# EAGLE schematic Sensor Board (EAGLE 6.5.0)
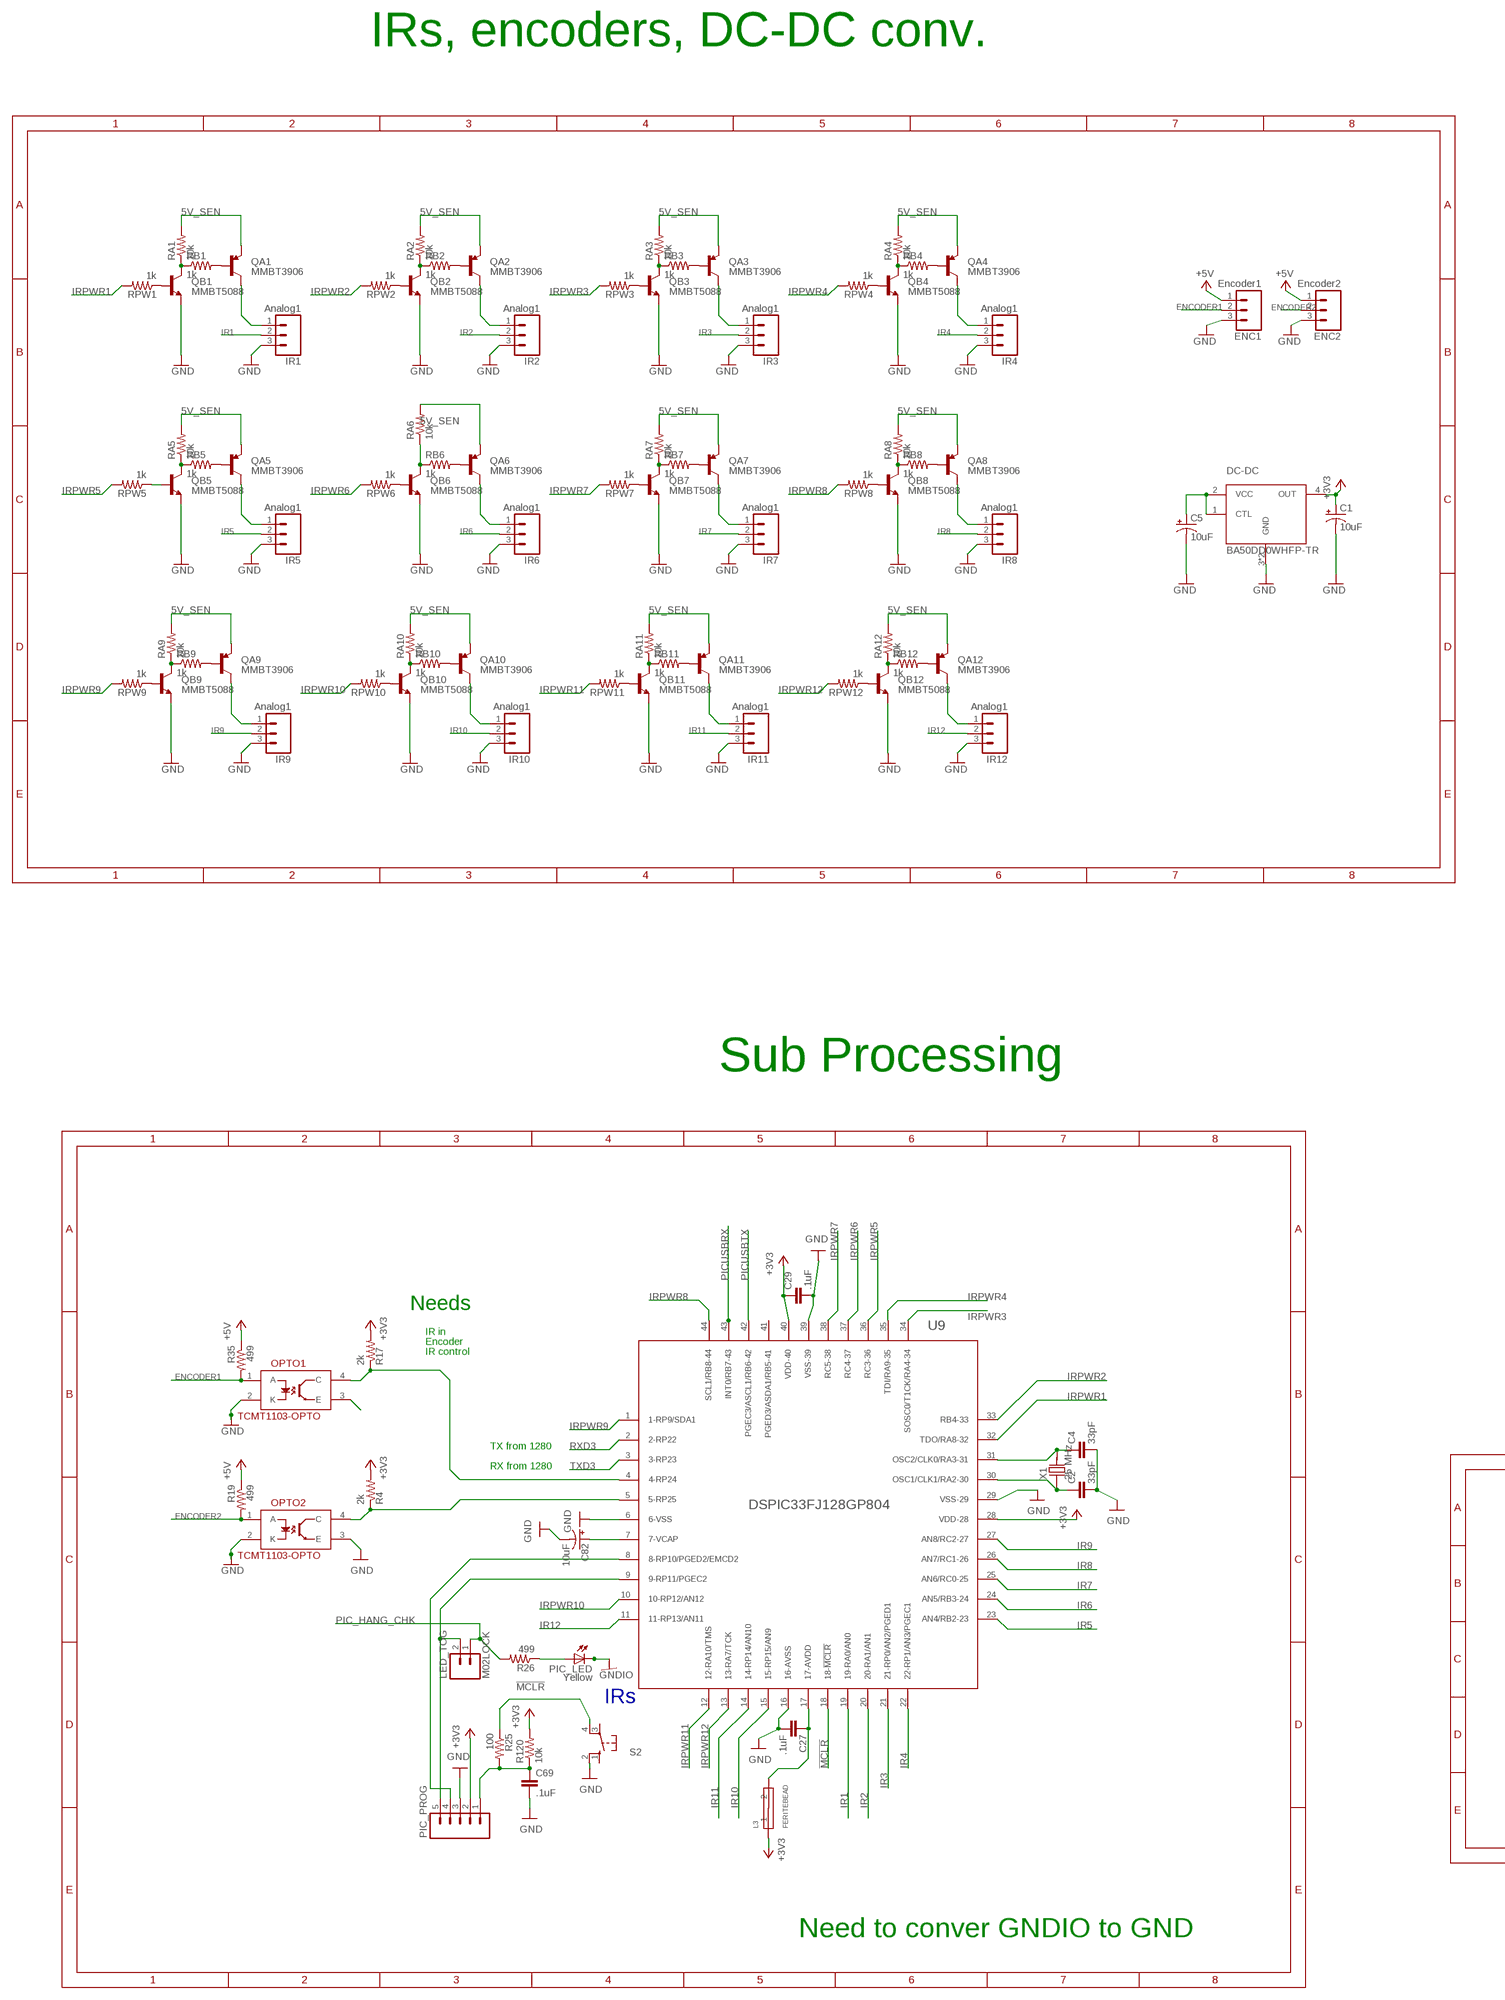
[diagram p0: schematic, sheet 1, part 1 of 3]
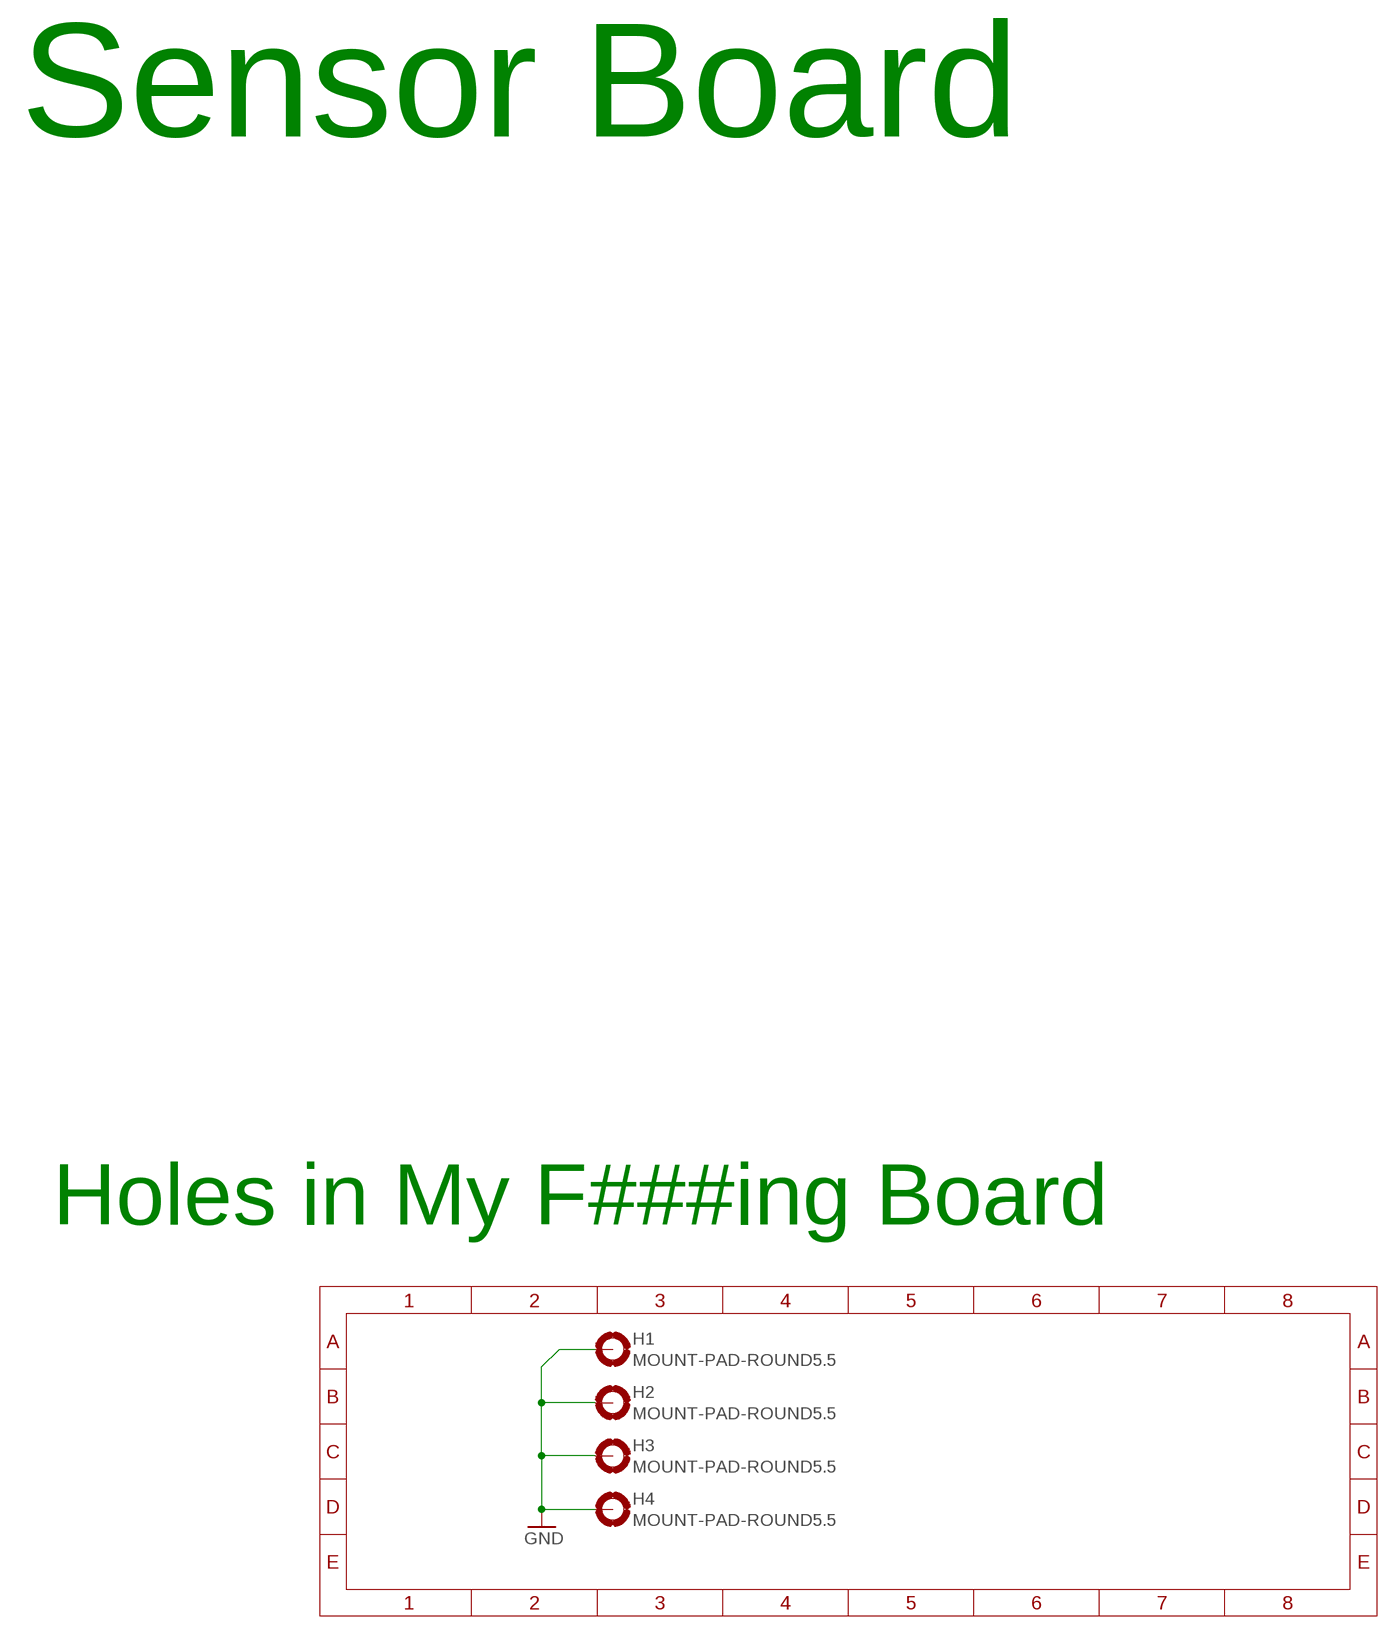
[diagram p1: schematic, sheet 1, part 2 of 3]
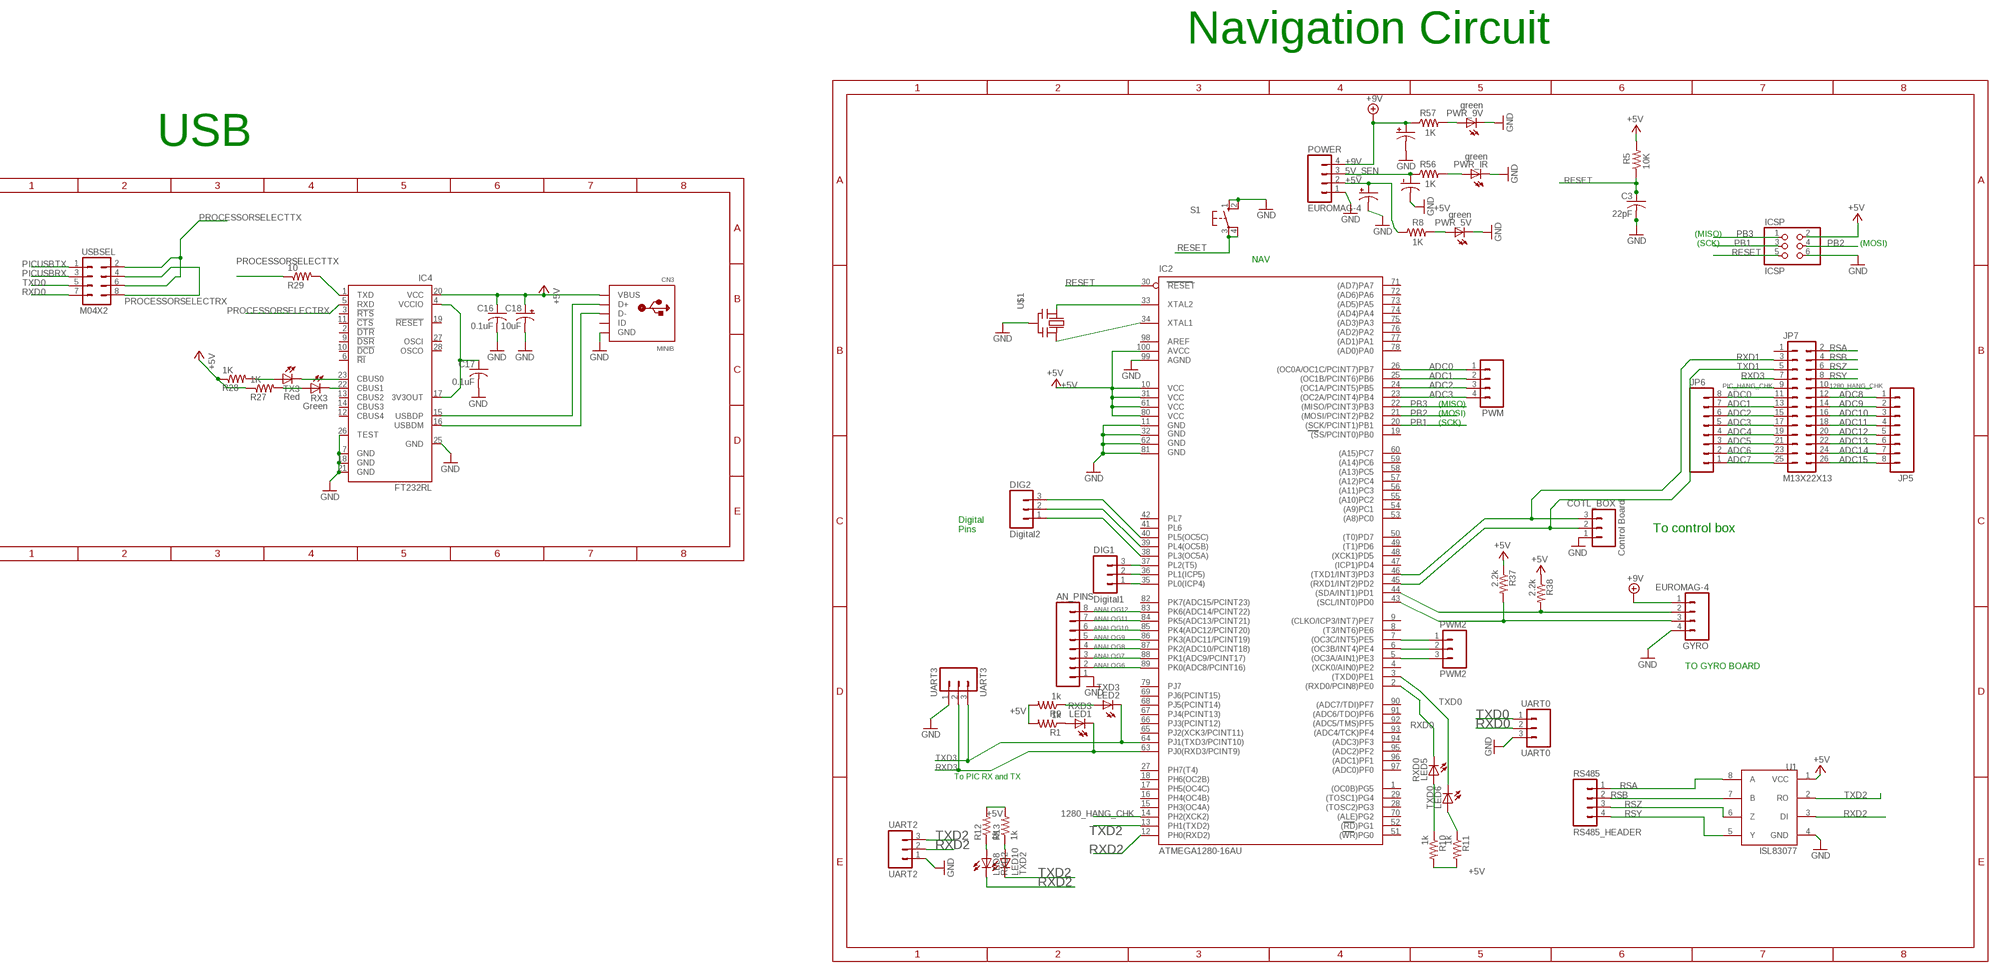
[diagram p2: schematic, sheet 1, part 3 of 3]

## Parts
AN_PINS  M08LOCK_LONGPADS  [1X08_LOCK_LONGPADS]
C1  10uF  CAP_POL1206  [EIA3216]
C2  33pF  1UF-25V-10%(0805)  [0805]
C3  22pF  C-USC0805K  [C0805K]
C4  33pF  1UF-25V-10%(0805)  [0805]
C5  10uF  CAP_POL1206  [EIA3216]
C16  0.1uF  C-USC0805K  [C0805K]
C17  0.1uF  C-USC0805K  [C0805K]
C18  10uF  CAP_POL3528-KIT  [EIA3528-KIT]
C27  .1uF  1UF-25V-10%(0805)  [0805]
C29  .1uF  1UF-25V-10%(0805)  [0805]
C69  .1uF  1UF-25V-10%(0805)  [0805]
C82  10uF  POLCAP  [POLC1206]
CAN1  EMVY160ADA101MF55G  CPOL-US140CLH-1010  [140CLH-1010]
CAN2  EMVY160ADA101MF55G  CPOL-US140CLH-1010  [140CLH-1010]
CAN3  EMVY160ADA101MF55G  CPOL-US140CLH-1010  [140CLH-1010]
CN3  MINIB  USBMINIB  [USB-MINIB]
COTL_BOX  Control Board  M03POLAR_LOCK  [MOLEX-1X3_LOCK]
DC-DC  BA50DD0WHFP-TR  [HRP5]
DIG1  Digital1  EUROMAG-390DEG  [M3]
DIG2  Digital2  EUROMAG-390DEG  [M3]
ENC1  Encoder1  EUROMAG-390DEG  [M3]
ENC2  Encoder2  EUROMAG-390DEG  [M3]
GYRO  EUROMAG-4  [M4]
H1  MOUNT-PAD-ROUND5.5  [5,5-PAD]
H2  MOUNT-PAD-ROUND5.5  [5,5-PAD]
H3  MOUNT-PAD-ROUND5.5  [5,5-PAD]
H4  MOUNT-PAD-ROUND5.5  [5,5-PAD]
IC2  ATMEGA1280-16AU  [TQFP100]
IC4  FT232RL  [SSOP28]
ICSP  ICSP  PINHD-2X3  [2X03]
IR1  Analog1  EUROMAG-390DEG  [M3]
IR2  Analog1  EUROMAG-390DEG  [M3]
IR3  Analog1  EUROMAG-390DEG  [M3]
IR4  Analog1  EUROMAG-390DEG  [M3]
IR5  Analog1  EUROMAG-390DEG  [M3]
IR6  Analog1  EUROMAG-390DEG  [M3]
IR7  Analog1  EUROMAG-390DEG  [M3]
IR8  Analog1  EUROMAG-390DEG  [M3]
IR9  Analog1  EUROMAG-390DEG  [M3]
IR10  Analog1  EUROMAG-390DEG  [M3]
IR11  Analog1  EUROMAG-390DEG  [M3]
IR12  Analog1  EUROMAG-390DEG  [M3]
JP5  M08LOCK_LONGPADS  [1X08_LOCK_LONGPADS]
JP6  M08LOCK_LONGPADS  [1X08_LOCK_LONGPADS]
JP7  M13X22X13  [2X13]
L3  FERITEBEAD  [0603]
LED1  RXD3  LEDCHIP-LED0805  [CHIP-LED0805]
LED2  TXD3  LEDCHIP-LED0805  [CHIP-LED0805]
LED5  RXD0  LEDCHIP-LED0805  [CHIP-LED0805]
LED6  TXD0  LEDCHIP-LED0805  [CHIP-LED0805]
LED8  RXD2  LEDCHIP-LED0805  [CHIP-LED0805]
LED10  TXD2  LEDCHIP-LED0805  [CHIP-LED0805]
LED_TOG  M02LOCK  [1X02_LOCK]
OPTO1  TCMT1103-OPTO  [SSOP-4]
OPTO2  TCMT1103-OPTO  [SSOP-4]
PIC_LED  Yellow  LEDCHIP-LED0805  [CHIP-LED0805]
PIC_PROG  M05LOCK_LONGPADS  [1X05_LOCK_LONGPADS]
POWER  EUROMAG-4  [M4]
PWM  M04POLAR  [MOLEX-1X4]
PWM2  PWM2  M03POLAR_LOCK  [MOLEX-1X3_LOCK]
PWR_5V  green  LEDCHIPLED_0805  [CHIPLED_0805]
PWR_9V  green  LEDCHIPLED_0805  [CHIPLED_0805]
PWR_IR  green  LEDCHIPLED_0805  [CHIPLED_0805]
QA1  MMBT3906  TRANSISTOR_PNPMMBT3906  [SOT23]
QA2  MMBT3906  TRANSISTOR_PNPMMBT3906  [SOT23]
QA3  MMBT3906  TRANSISTOR_PNPMMBT3906  [SOT23]
QA4  MMBT3906  TRANSISTOR_PNPMMBT3906  [SOT23]
QA5  MMBT3906  TRANSISTOR_PNPMMBT3906  [SOT23]
QA6  MMBT3906  TRANSISTOR_PNPMMBT3906  [SOT23]
QA7  MMBT3906  TRANSISTOR_PNPMMBT3906  [SOT23]
QA8  MMBT3906  TRANSISTOR_PNPMMBT3906  [SOT23]
QA9  MMBT3906  TRANSISTOR_PNPMMBT3906  [SOT23]
QA10  MMBT3906  TRANSISTOR_PNPMMBT3906  [SOT23]
QA11  MMBT3906  TRANSISTOR_PNPMMBT3906  [SOT23]
QA12  MMBT3906  TRANSISTOR_PNPMMBT3906  [SOT23]
QB1  MMBT5088  TRANSISTOR_NPNMMBT5088  [SOT23]
QB2  MMBT5088  TRANSISTOR_NPNMMBT5088  [SOT23]
QB3  MMBT5088  TRANSISTOR_NPNMMBT5088  [SOT23]
QB4  MMBT5088  TRANSISTOR_NPNMMBT5088  [SOT23]
QB5  MMBT5088  TRANSISTOR_NPNMMBT5088  [SOT23]
QB6  MMBT5088  TRANSISTOR_NPNMMBT5088  [SOT23]
QB7  MMBT5088  TRANSISTOR_NPNMMBT5088  [SOT23]
QB8  MMBT5088  TRANSISTOR_NPNMMBT5088  [SOT23]
QB9  MMBT5088  TRANSISTOR_NPNMMBT5088  [SOT23]
QB10  MMBT5088  TRANSISTOR_NPNMMBT5088  [SOT23]
QB11  MMBT5088  TRANSISTOR_NPNMMBT5088  [SOT23]
QB12  MMBT5088  TRANSISTOR_NPNMMBT5088  [SOT23]
R1  1k  R-US_R0805  [R0805]
R4  2k  R-US_R0805  [R0805]
R5  10K  R-US_R0805  [R0805]
R8  1K  R-US_R0805  [R0805]
R9  1k  R-US_R0805  [R0805]
R10  1k  R-US_R0805  [R0805]
R11  1k  R-US_R0805  [R0805]
R12  1k  R-US_R0805  [R0805]
R13  1k  R-US_R0805  [R0805]
R17  2k  R-US_R0805  [R0805]
R19  499  R-US_R0805  [R0805]
R25  100  R-US_R0805  [R0805]
R26  499  R-US_R0805  [R0805]
R27  1K  R-US_R0805  [R0805]
R28  1K  R-US_R0805  [R0805]
R29  10  R-US_R0805  [R0805]
R35  499  R-US_R0805  [R0805]
R37  2.2k  R-US_R0805  [R0805]
R38  2.2k  R-US_R0805  [R0805]
R56  1K  R-US_R0805  [R0805]
R57  1K  R-US_R0805  [R0805]
R120  10k  R-US_R0805  [R0805]
RA1  10k  RESISTOR0805-RES  [0805]
RA2  10k  RESISTOR0805-RES  [0805]
RA3  10k  RESISTOR0805-RES  [0805]
RA4  10k  RESISTOR0805-RES  [0805]
RA5  10k  RESISTOR0805-RES  [0805]
RA6  10k  RESISTOR0805-RES  [0805]
RA7  10k  RESISTOR0805-RES  [0805]
RA8  10k  RESISTOR0805-RES  [0805]
RA9  10k  RESISTOR0805-RES  [0805]
RA10  10k  RESISTOR0805-RES  [0805]
RA11  10k  RESISTOR0805-RES  [0805]
RA12  10k  RESISTOR0805-RES  [0805]
RB1  1k  RESISTOR0805-RES  [0805]
RB2  1k  RESISTOR0805-RES  [0805]
RB3  1k  RESISTOR0805-RES  [0805]
RB4  1k  RESISTOR0805-RES  [0805]
RB5  1k  RESISTOR0805-RES  [0805]
RB6  1k  RESISTOR0805-RES  [0805]
RB7  1k  RESISTOR0805-RES  [0805]
RB8  1k  RESISTOR0805-RES  [0805]
RB9  1k  RESISTOR0805-RES  [0805]
RB10  1k  RESISTOR0805-RES  [0805]
RB11  1k  RESISTOR0805-RES  [0805]
RB12  1k  RESISTOR0805-RES  [0805]
RPW1  1k  RESISTOR0805-RES  [0805]
RPW2  1k  RESISTOR0805-RES  [0805]
RPW3  1k  RESISTOR0805-RES  [0805]
RPW4  1k  RESISTOR0805-RES  [0805]
RPW5  1k  RESISTOR0805-RES  [0805]
RPW6  1k  RESISTOR0805-RES  [0805]
RPW7  1k  RESISTOR0805-RES  [0805]
RPW8  1k  RESISTOR0805-RES  [0805]
RPW9  1k  RESISTOR0805-RES  [0805]
RPW10  1k  RESISTOR0805-RES  [0805]
RPW11  1k  RESISTOR0805-RES  [0805]
RPW12  1k  RESISTOR0805-RES  [0805]
RS485_HEADER  RS485  EUROMAG-4UP  [M4-90]
RX3  Green  LEDCHIP-LED0805  [CHIP-LED0805]
S1  10-XX  [B3F-10XX]
S2  10-XX  [B3F-10XX]
TX3  Red  LEDCHIP-LED0805  [CHIP-LED0805]
U1  ISL83077  [SO08]
U9  DSPIC33FJ128GP804  DSPIC33FJ128GP204  [TQFP-44]
U$1  CERMOSCILL-AWCSR  [AWCSR]
UART0  UART0  M03PTH  [1X03]
UART2  UART2  M03PTH  [1X03]
UART3  UART3  M03PTH  [1X03]
USBSEL  M04X2  [2X4]
X1  25 MHz  XRCGBCRYSTAL  [XRCGB-CYL]

## Nets
5V_SEN: CAN2.+ POWER.3 QA1.2(E) QA2.2(E) QA3.2(E) QA4.2(E) QA5.2(E) QA6.2(E) QA7.2(E) QA8.2(E) QA9.2(E) QA10.2(E) QA11.2(E) QA12.2(E) R56.1 RA1.2 RA2.2 RA3.2 RA4.2 RA5.2 RA6.2 RA7.2 RA8.2 RA9.2 RA10.2 RA11.2 RA12.2
1280_HANG_CHK: IC2.14(PH2(XCK2)) JP7.10
!MCLR: R25.1 S2.4(P1) U9.18(18-!MCLR)
+3V3: C1.A(+) C29.1 DC-DC.4(OUT) L3.1 PIC_PROG.2 R4.2 R17.2 R120.2 U9.28(VDD-28) U9.40(VDD-40)
+5V [usbvcc]: C5.A(+) C16.1 C18.A(+) CAN3.+ CN3.VBUS DC-DC.1(CTL) DC-DC.2(VCC) ENC1.1 ENC2.1 IC2.10(VCC) IC2.31(VCC1) IC2.61(VCC2) IC2.80(VCC3) IC2.100(AVCC) IC4.20(VCC) ICSP.2 POWER.2 R1.2 R5.2 R8.1 R9.2 R10.2 R11.2 R12.2 R13.2 R19.1 R27.1 R28.1 R35.1 R37.1 R38.1 U1.1(VCC)
+9V: CAN1.+ GYRO.1 POWER.4 R57.1
ADC0: IC2.26((OC0A/OC1C/PCINT7)PB7) JP6.8 JP7.11 PWM.1
ADC1: IC2.25((OC1B/PCINT6)PB6) JP6.7 JP7.13 PWM.2
ADC2: IC2.24((OC1A/PCINT5)PB5) JP6.6 JP7.15 PWM.3
ADC3: IC2.23((OC2A/PCINT4)PB4) JP6.5 JP7.17 PWM.4
ADC4: JP6.4 JP7.19
ADC5: JP6.3 JP7.21
ADC6: JP6.2 JP7.23
ADC7: JP6.1 JP7.25
ADC8: JP5.1 JP7.12
ADC9: JP5.2 JP7.14
ADC10: JP5.3 JP7.16
ADC11: JP5.4 JP7.18
ADC12: JP5.5 JP7.20
ADC13: JP5.6 JP7.22
ADC14: JP5.7 JP7.24
ADC15: JP5.8 JP7.26
ANALOG6: AN_PINS.2 IC2.89(PK0(ADC8/PCINT16))
ANALOG7: AN_PINS.3 IC2.88(PK1(ADC9/PCINT17))
ANALOG8: AN_PINS.4 IC2.87(PK2(ADC10/PCINT18))
ANALOG9: AN_PINS.5 IC2.86(PK3(ADC11/PCINT19))
ANALOG10: AN_PINS.6 IC2.85(PK4(ADC12/PCINT20))
ANALOG11: AN_PINS.7 IC2.84(PK5(ADC13/PCINT21))
ANALOG12: AN_PINS.8 IC2.83(PK6(ADC14/PCINT22))
ANBNKJDFBNDFKJL: OPTO1.4(C) R17.1 U9.4(4-RP24)
ANBNKJDFBNDFKJL1: OPTO2.4(C) R4.1 U9.5(5-RP25)
ENCODER1: ENC1.2 OPTO1.1(A) R35.2
ENCODER2: ENC2.2 OPTO2.1(A) R19.2
GND: AN_PINS.1 C1.C(-) C2.2 C3.2 C4.2 C5.C(-) C16.2 C17.2 C18.C(-) C27.2 C29.2 C69.2 C82.2(-) CAN1.- CAN2.- CAN3.- CN3.GND COTL_BOX.1 DC-DC.3(GND) DC-DC.G(GND) ENC1.3 ENC2.3 GYRO.4 H1.B5,5(MOUNT) H2.B5,5(MOUNT) H3.B5,5(MOUNT) H4.B5,5(MOUNT) IC2.11(GND) IC2.32(GND1) IC2.62(GND2) IC2.81(GND3) IC2.99(AGND) IC4.7(GND) IC4.18(GND) IC4.21(GND) IC4.25(GND) IC4.26(TEST) ICSP.6 IR1.3 IR2.3 IR3.3 IR4.3 IR5.3 IR6.3 IR7.3 IR8.3 IR9.3 IR10.3 IR11.3 IR12.3 OPTO1.2(K) OPTO2.2(K) OPTO2.3(E) PIC_PROG.3 POWER.1 PWR_5V.C PWR_9V.C PWR_IR.C QB1.2(E) QB2.2(E) QB3.2(E) QB4.2(E) QB5.2(E) QB6.2(E) QB7.2(E) QB8.2(E) QB9.2(E) QB10.2(E) QB11.2(E) QB12.2(E) S1.1(S) S1.2(S1) S2.2(S1) U1.4(GND) U9.6(6-VSS) U9.16(16-AVSS) U9.29(VSS-29) U9.39(VSS-39) U$1.2(GND) UART0.3 UART2.1 UART3.1
GNDIO: PIC_LED.C
IR1: IR1.2 U9.19(19-RA0/AN0)
IR2: IR2.2 U9.20(20-RA1/AN1)
IR3: IR3.2 U9.21(21-RP0/AN2/PGED1)
IR4: IR4.2 U9.22(22-RP1/AN3/PGEC1)
IR5: IR5.2 U9.23(AN4/RB2-23)
IR6: IR6.2 U9.24(AN5/RB3-24)
IR7: IR7.2 U9.25(AN6/RC0-25)
IR8: IR8.2 U9.26(AN7/RC1-26)
IR9: IR9.2 U9.27(AN8/RC2-27)
IR10: IR10.2 U9.15(15-RP15/AN9)
IR11: IR11.2 U9.14(14-RP14/AN10)
IR12: IR12.2 U9.11(11-RP13/AN11)
IRPWR1: RPW1.2 U9.32(TDO/RA8-32)
IRPWR2: RPW2.2 U9.33(RB4-33)
IRPWR3: RPW3.2 U9.34(SOSC0/T1CK/RA4-34)
IRPWR4: RPW4.2 U9.35(TDI/RA9-35)
IRPWR5: RPW5.2 U9.36(RC3-36)
IRPWR6: RPW6.2 U9.37(RC4-37)
IRPWR7: RPW7.2 U9.38(RC5-38)
IRPWR8: RPW8.2 U9.44(SCL1/RB8-44)
IRPWR9: RPW9.2 U9.1(1-RP9/SDA1)
IRPWR10: RPW10.2 U9.10(10-RP12/AN12)
IRPWR11: RPW11.2 U9.12(12-RA10/TMS)
IRPWR12: RPW12.2 U9.13(13-RA7/TCK)
N$1: QA2.1(B) RB2.2
N$2: QB2.3(C) RA2.1 RB2.1
N$3: PWR_5V.A R8.2
N$4: QB2.1(B) RPW2.1
N$5: QA1.1(B) RB1.2
N$6: IC2.34(XTAL1) U$1.3(OUT)
N$7: IC2.33(XTAL2) U$1.1(IN)
N$8: QB1.3(C) RA1.1 RB1.1
N$9: QB1.1(B) RPW1.1
N$10: IR1.1 QA1.3(C)
N$11: PIC_PROG.4 U9.8(8-RP10/PGED2/EMCD2)
N$12: LED2.A R9.1
N$13: C4.1 U9.31(OSC2/CLK0/RA3-31) X1.3(OUT)
N$14: C2.1 U9.30(OSC1/CLK1/RA2-30) X1.1(IN)
N$15: C69.1 PIC_PROG.1 R25.2 R120.1
N$16: C82.1(+) U9.7(7-VCAP)
N$17: IR2.1 QA2.3(C)
N$18: QA3.1(B) RB3.2
N$19: QB3.3(C) RA3.1 RB3.1
N$20: LED_TOG.2 PIC_PROG.5 U9.9(9-RP11/PGEC2)
N$21: QB3.1(B) RPW3.1
N$22: IC2.7((OC3C/INT5)PE5) PWM2.1
N$23: C27.1 L3.2 U9.17(17-AVDD)
N$24: IR3.1 QA3.3(C)
N$25: QA4.1(B) RB4.2
N$26: QB4.3(C) RA4.1 RB4.1
N$27: QB4.1(B) RPW4.1
N$28: IR4.1 QA4.3(C)
N$29: QA5.1(B) RB5.2
N$30: IC2.6((OC3B/INT4)PE4) PWM2.2
N$31: LED1.A R1.1
N$32: IC2.5((OC3A/AIN1)PE3) PWM2.3
N$33: QB5.3(C) RA5.1 RB5.1
N$34: QB5.1(B) RPW5.1
N$35: LED10.A R13.1
N$36: IR5.1 QA5.3(C)
N$37: PWR_IR.A R56.2
N$38: LED8.A R12.1
N$39: PWR_9V.A R57.2
N$40: DIG1.1 IC2.35(PL0(ICP4))
N$41: LED6.A R11.1
N$44: DIG1.2 IC2.36(PL1(ICP5))
N$45: QA6.1(B) RB6.2
N$46: DIG1.3 IC2.37(PL2(T5))
N$47: DIG2.1 IC2.38(PL3(OC5A))
N$48: QB6.3(C) RA6.1 RB6.1
N$49: DIG2.2 IC2.39(PL4(OC5B))
N$50: DIG2.3 IC2.40(PL5(OC5C))
N$51: LED5.A R10.1
N$52: QB6.1(B) RPW6.1
N$53: IR6.1 QA6.3(C)
N$54: QA7.1(B) RB7.2
N$55: QB7.3(C) RA7.1 RB7.1
N$56: QB7.1(B) RPW7.1
N$57: GYRO.2 IC2.44((SDA/INT1)PD1) R38.2
N$58: GYRO.3 IC2.43((SCL/INT0)PD0) R37.2
N$59: IR7.1 QA7.3(C)
N$60: QA8.1(B) RB8.2
N$61: QB8.3(C) RA8.1 RB8.1
N$62: QB8.1(B) RPW8.1
N$63: IR8.1 QA8.3(C)
N$64: QA9.1(B) RB9.2
N$65: QB9.3(C) RA9.1 RB9.1
N$66: QB9.1(B) RPW9.1
N$67: IR9.1 QA9.3(C)
N$68: QA10.1(B) RB10.2
N$69: QB10.3(C) RA10.1 RB10.1
N$70: QB10.1(B) RPW10.1
N$71: CN3.D+ IC4.15(USBDP)
N$72: CN3.D- IC4.16(USBDM)
N$73: IC4.23(CBUS0) TX3.C
N$74: IC4.22(CBUS1) RX3.C
N$75: R27.2 RX3.A
N$76: R28.2 TX3.A
N$77: IC4.1(TXD) R29.2
N$78: C17.1 IC4.4(VCCIO) IC4.17(3V3OUT)
N$79: IR10.1 QA10.3(C)
N$80: QA11.1(B) RB11.2
N$81: QB11.3(C) RA11.1 RB11.1
N$82: QB11.1(B) RPW11.1
N$83: IR11.1 QA11.3(C)
N$84: QA12.1(B) RB12.2
N$85: QB12.3(C) RA12.1 RB12.1
N$86: QB12.1(B) RPW12.1
N$87: IR12.1 QA12.3(C)
N$91: PIC_LED.A R26.1
N$92: OPTO1.3(E)
PB1: IC2.20((SCK/PCINT1)PB1) ICSP.3
PB2: IC2.21((MOSI/PCINT2)PB2) ICSP.4
PB3: IC2.22((MISO/PCINT3)PB3) ICSP.1
PIC_HANG_CHK: JP7.9 LED_TOG.1 R26.2
PICUSBRX: U9.43(INT0/RB7-43) USBSEL.3
PICUSBTX: U9.42(PGEC3/ASCL1/RB6-42) USBSEL.1
PROCESSORSELECTRX: IC4.5(RXD) USBSEL.4 USBSEL.8
PROCESSORSELECTTX: R29.1 USBSEL.2 USBSEL.6
RESET: C3.1 IC2.30(RESET) ICSP.5 R5.1 S1.3(P) S1.4(P1)
RSA: JP7.2 RS485_HEADER.1 U1.8(A)
RSB: JP7.4 RS485_HEADER.2 U1.7(B)
RSY: JP7.8 RS485_HEADER.4 U1.5(Y)
RSZ: JP7.6 RS485_HEADER.3 U1.6(Z)
RXD0: IC2.2((RXD0/PCIN8)PE0) LED5.C UART0.2 USBSEL.7
RXD1: COTL_BOX.3 IC2.46((TXD1/INT3)PD3) JP7.3
RXD2: IC2.12(PH0(RXD2)) LED8.C U1.3(DI) UART2.2
RXD3: IC2.63(PJ0(RXD3/PCINT9)) JP7.7 LED1.C U9.2(2-RP22) UART3.2
TXD0: IC2.3((TXD0)PE1) LED6.C UART0.1 USBSEL.5
TXD1: COTL_BOX.2 IC2.45((RXD1/INT2)PD2) JP7.5
TXD2: IC2.13(PH1(TXD2)) LED10.C U1.2(RO) UART2.3
TXD3: IC2.64(PJ1(TXD3/PCINT10)) LED2.C U9.3(3-RP23) UART3.3
Unconnected: CN3.ID IC2.1((OC0B)PG5) IC2.4((XCK0/AIN0)PE2) IC2.8((T3/INT6)PE6) IC2.9((CLKO/ICP3/INT7)PE7) IC2.15(PH3(OC4A)) IC2.16(PH4(OC4B)) IC2.17(PH5(OC4C)) IC2.18(PH6(OC2B)) IC2.19((SS/PCINT0)PB0) IC2.27(PH7(T4)) IC2.28((TOSC2)PG3) IC2.29((TOSC1)PG4) IC2.41(PL6) IC2.42(PL7) IC2.47((ICP1)PD4) IC2.48((XCK1)PD5) IC2.49((T1)PD6) IC2.50((T0)PD7) IC2.51((WR)PG0) IC2.52((RD)PG1) IC2.53((A8)PC0) IC2.54((A9)PC1) IC2.55((A10)PC2) IC2.56((A11)PC3) IC2.57((A12)PC4) IC2.58((A13)PC5) IC2.59((A14)PC6) IC2.60((A15)PC7) IC2.65(PJ2(XCK3/PCINT11)) IC2.66(PJ3(PCINT12)) IC2.67(PJ4(PCINT13)) IC2.68(PJ5(PCINT14)) IC2.69(PJ6(PCINT15)) IC2.70((ALE)PG2) IC2.71((AD7)PA7) IC2.72((AD6)PA6) IC2.73((AD5)PA5) IC2.74((AD4)PA4) IC2.75((AD3)PA3) IC2.76((AD2)PA2) IC2.77((AD1)PA1) IC2.78((AD0)PA0) IC2.79(PJ7) IC2.82(PK7(ADC15/PCINT23)) IC2.90((ADC7/TDI)PF7) IC2.91((ADC6/TDO)PF6) IC2.92((ADC5/TMS)PF5) IC2.93((ADC4/TCK)PF4) IC2.94((ADC3)PF3) IC2.95((ADC2)PF2) IC2.96((ADC1)PF1) IC2.97((ADC0)PF0) IC2.98(AREF) IC4.2(!DTR) IC4.3(!RTS) IC4.6(!RI) IC4.9(!DSR) IC4.10(!DCD) IC4.11(!CTS) IC4.12(CBUS4) IC4.13(CBUS2) IC4.14(CBUS3) IC4.19(!RESET) IC4.27(OSCI) IC4.28(OSCO) JP7.1 S2.1(S) S2.3(P) U9.41(PGED3/ASDA1/RB5-41)

## Notes on the sheet
- Sensor Board
- IRs, encoders, DC-DC conv.
- Holes in My F###ing Board
- Sub Processing
- Needs | Navigation Circuit
- IR in
- Encoder
- IR control
- USB
- TX from 1280
- RX from 1280
- (MISO)
- (SCK) | (MOSI)
- NAV
- (MISO)
- IRs
- (MOSI)
- (SCK)
- Digital
  Pins
- To control box
- Need to conver GNDIO to GND
- TO GYRO BOARD
- To PIC RX and TX

## Library data of the parts
AN_PINS JP5 JP6 = SparkFun-Connectors:M08: Header 8 Standard 8-pin 0.1" header. Use with straight break away headers (SKU : PRT-00116), right angle break away headers (PRT-00553), swiss pins (PRT-00743), machine pins (PRT-00117), and female headers (PRT-00115).
C1 C5 = SparkFun-Capacitors:CAP_POL: Capacitor Polarized These are standard SMD and PTH capacitors. Normally 10uF, 47uF, and 100uF in electrolytic and tantalum varieties. Always verify the external diameter of the through hole cap, it varies with capacity, voltage, and manufacturer. The EIA devices should be standard.
C2 C4 C27 C29 C69 = SparkFun-Capacitors:1UF-25V-10%(0805): CAP-08064; PROD_ID: CAP-08064; VALUE: 1uF
C3 C16 C17 = adafruit:C-US: CAPACITOR, American symbol
C18 = SparkFun:CAP_POL: Capacitor Polarized These are standard SMD and PTH capacitors. Normally 10uF, 47uF, and 100uF in electrolytic and tantalum varieties. Always verify the external diameter of the through hole cap, it varies with capacity, voltage, and manufacturer. The EIA devices should be standard.
C82 = RJ's_parts:POLCAP
CAN1-CAN3 = rcl:CPOL-US: POLARIZED CAPACITOR, American symbol
CN3 = adafruit:USB: USB Connectors USBMINIB - Surface Mount Female Mini-B USB Connector 4UConnector: 06564 By microbuilder.eu Thru-hole RA Female Mini-B USB Connector 4UConnector: 18732 By ladyada.net
COTL_BOX PWM2 UART0 UART2 UART3 = SparkFun-Connectors:M03: Header 3 Standard 3-pin 0.1" header. Use with straight break away headers (SKU : PRT-00116), right angle break away headers (PRT-00553), swiss pins (PRT-00743), machine pins (PRT-00117), and female headers (PRT-00115). Molex polarized connector foot print use with SKU : PRT-08232 with associated crimp pins and housings.
DC-DC = NASA_LIB:BA50DD0WHFP-TR
DIG1 DIG2 ENC1 ENC2 IR1-IR12 = NASA_LIB:EUROMAG-3
GYRO POWER RS485_HEADER = NASA_LIB:EUROMAG-4
H1-H4 = holes:MOUNT-PAD-ROUND: MOUNTING PAD, round
IC2 = atmel-2005:ATMEGA*: MICROCONTROLLER 64/128/256 Kbytes FLASH 4 Kbytes EEPROM 8 Kbytes SRAM 86 General Purpose I/O pins 12-channels16-bit PWM 4 x Serial USARTs 16-channels 10-bit A/D
IC4 = ftdichip:FT232R: Source: http://www.ftdichip.com/Documents/DataSheets/DS_FT232R_v104.pdf
ICSP = pinhead:PINHD-2X3: PIN HEADER
JP7 = SparkFun-Connectors:M13X2: 0.1" spaced headers
L3 = EmEndev:FERITEBEAD
LED1 LED2 LED5 LED6 LED8 LED10 PIC_LED PWR_5V PWR_9V PWR_IR RX3 TX3 = adafruit:LED: LED OSRAM: - CHIPLED LG R971, LG N971, LY N971, LG Q971, LY Q971, LO R971, LY R971 LH N974, LH R974 LS Q976, LO Q976, LY Q976 LO Q996 - Hyper CHIPLED LW Q18S LB Q993, LB Q99A, LB R99A - SideLED LS A670, LO A670, LY A670, LG A670, LP A670 LB A673, LV A673, LT A673, LW A673 LH A674 LY A675 LS A676, LA A676, LO A676, LY A676, LW A676 LS A679, LY A679, LG A679 - Hyper Micro SIDELED® LS Y876, LA Y876, LO Y876, LY Y876 LT Y87S - SmartLED LW L88C, LW L88S LB L89C, LB L89S, LG L890 LS L89K, LO L89K, LY L89K LS L896, LA L896, LO L896, LY L896 - TOPLED LS T670, LO T670, LY T670, LG T670, LP T670 LSG T670, LSP T670, LSY T670, LOP T670, LYG T670 LG T671, LOG T671, LSG T671 LB T673, LV T673, LT T673, LW T673 LH T674 LS T676, LA T676, LO T676, LY T676, LB T676, LH T676, LSB T676, LW T676 LB T67C, LV T67C, LT T67C, LS T67K, LO T67K, LY T67K, LW E67C LS E67B, LA E67B, LO E67B, LY E67B, LB E67C, LV E67C, LT E67C LW T67C LS T679, LY T679, LG T679 LS T770, LO T770, LY T770, LG T770, LP T770 LB T773, LV T773, LT T773, LW T773 LH T774 LS E675, LA E675, LY E675, LS T675 LS T776, LA T776, LO T776, LY T776, LB T776 LHGB T686 LT T68C, LB T68C - Hyper Mini TOPLED® LB M676 - Mini TOPLED Santana® LG M470 LS M47K, LO M47K, LY M47K Source: http://www.osram.convergy.de/
LED_TOG = SparkFun-Connectors:M02: Standard 2-pin 0.1" header. Use with - straight break away headers ( PRT-00116) - right angle break away headers (PRT-00553) - swiss pins (PRT-00743) - machine pins (PRT-00117) - female headers (PRT-00115) Molex polarized connector foot print use with: PRT-08233 with associated crimp pins and housings. 2.54_SCREWTERM for use with PRT-10571. 3.5mm Screw Terminal footprints for PRT-08084 5mm Screw Terminal footprints for use with PRT-08433
OPTO1 OPTO2 = SparkFun:TCMT1103-OPTO
PIC_PROG = SparkFun-Connectors:M05: Header 5 Standard 5-pin 0.1" header. Use with straight break away headers (SKU : PRT-00116), right angle break away headers (PRT-00553), swiss pins (PRT-00743), machine pins (PRT-00117), and female headers (PRT-00115). Molex polarized connector foot print use with SKU : PRT-08230 with associated crimp pins and housings.
PWM = SparkFun-Connectors:M04: Header 4 Standard 4-pin 0.1" header. Use with straight break away headers (SKU : PRT-00116), right angle break away headers (PRT-00553), swiss pins (PRT-00743), machine pins (PRT-00117), and female headers (PRT-00115). Molex polarized connector foot print use with SKU : PRT-08231 with associated crimp pins and housings. 1MM SMD Version SKU: PRT-10208
QA1-QA12 = SparkFun-DiscreteSemi:TRANSISTOR_PNP: Generic PNP BJT Double check pinouts against datasheets- not all devices are the same! MMBT3906 - 40V 200mA SOT-23 (TRANS-08052) MMBT4403 - 40V 600mA SOT-23 (TRANS-09245); PROD_ID: TRANS-08052
QB1-QB12 = SparkFun-DiscreteSemi:TRANSISTOR_NPN: Generic NPN BJT MMBT2222A - TRANS-08049 (SOT-23, 1A 40V) MPSA42 - TRANS-09116 (SOT-23, 500mA 300V) MMBT5088LT1G - TRANS-11160 (SOT-23, 50 mA 30V); PROD_ID: TRANS-11160
R1 R4 R9-R13 R17 R19 R25-R29 R35 R37 R38 R120 = adafruit:R-US_: RESISTOR, American symbol
R5 R8 R56 R57 = 2 pin AVR ISP Pin Connector:R-US_: RESISTOR, American symbol
RA1-RA12 RB1-RB12 RPW1-RPW12 = SparkFun-Passives:RESISTOR: Resistor Basic schematic elements and footprints for 0603, 1206, and PTH resistors.
S1 S2 = switch-omron:10-XX: OMRON SWITCH
U1 = NASA_LIB:ISL83077
U9 = EmEndev:DSPIC33FJ128GP204
U$1 = adafruit:CERMOSCILL: Ceramic oscillator with built in capacitors such as ZTT-12MHz http://www.ladyada.net/library/eagle
USBSEL = SparkFun-Connectors:M04X2: .1" header, two rows of four.
X1 = RJ's_parts:XRCGBCRYSTAL

## Net classes
2 gnd: width 0.305 mm, drill 0.711 mm, clearance 0.203 mm
3 usbvcc: width 0.508 mm, drill 0.711 mm, clearance 0.203 mm